# Altium schematic sheet Sheet1.SchDoc
size A4
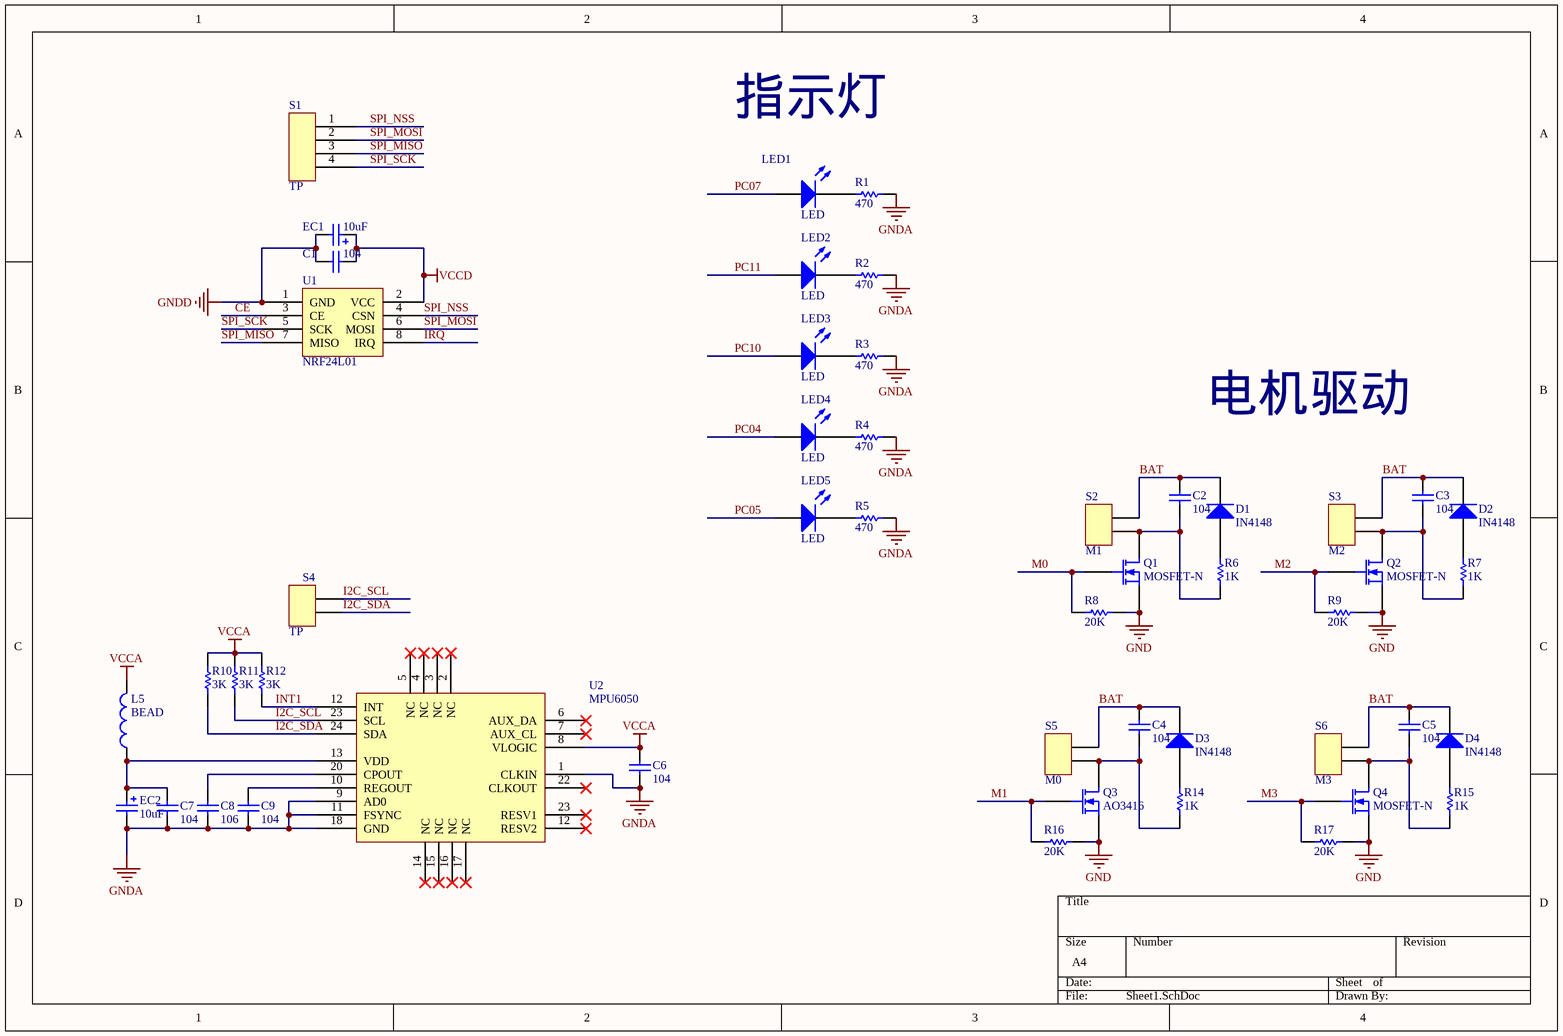
[diagram p0: Sheet1.SchDoc]

## Parts
C1  104  [0603]
C2  104  [0603]
C3  104  [0603]
C4  104  [0603]
C5  104  [0603]
C6  104  [0603]
C7  104  [0603]
C8  106  [0805]
C9  104  [0603]
D1  IN4148  [1206]
D2  IN4148  [1206]
D3  IN4148  [1206]
D4  IN4148  [1206]
EC1  10uF  [1206]
EC2  10uF  [1206]
L5  BEAD  [0603]
LED1  LED  [0805]
LED2  LED  [0805]
LED3  LED  [0805]
LED4  LED  [0805]
LED5  LED  [0805]
Q1  MOSFET-N  [SOT-23_N]
Q2  MOSFET-N  [SOT-23_N]
Q3  AO3416  [SOT-23_N]
Q4  MOSFET-N  [SOT-23_N]
R1  470  [0603]
R2  470  [0603]
R3  470  [0603]
R4  470  [0603]
R5  470  [0603]
R6  1K  [0603]
R7  1K  [0603]
R8  20K  [0603]
R9  20K  [0603]
R10  3K  [0603]
R11  3K  [0603]
R12  3K  [0603]
R14  1K  [0603]
R15  1K  [0603]
R16  20K  [0603]
R17  20K  [0603]
S1  TP  [TP4]
S2  M1  [0805]
S3  M2  [0805]
S4  TP  [TP2]
S5  M0  [0805]
S6  M3  [0805]
U1  NRF24L01  [CN8]
U2  MPU6050  [QFN50P400X400X95_HS-25N]

## Nets
GND: Q1.3(S) Q2.3(S) Q3.3(S) Q4.3(S) R8.2 R9.2 R16.2 R17.2
GNDA: C6.2 C7.1 C8.2 C9.2 EC2.2 R1.2 R2.2 R3.2 R4.2 R5.2 U2.1(CLKIN) U2.9(AD0) U2.11(FSYNC) U2.18(GND)
GNDD: C1.1 EC1.2 U1.1(GND)
VCCA: C6.1 L5.2 R10.2 R11.2 R12.2 U2.8(VLOGIC)
VCCD: C1.2 EC1.1 U1.2(VCC)
BAT: C2.2 C3.2 C4.2 C5.2 D1.2(K) D2.2(K) D3.2(K) D4.2(K) S2.1 S3.1 S5.1 S6.1
CE: U1.3(CE)
I2C_SCL: R11.1 S4.1 U2.23(SCL)
I2C_SDA: R10.1 S4.2 U2.24(SDA)
INT1: R12.1 U2.12(INT)
IRQ: U1.8(IRQ)
M0: Q1.2(G) R8.1
M1: Q3.2(G) R16.1
M2: Q2.2(G) R9.1
M3: Q4.2(G) R17.1
PC04: LED4.1(A)
PC05: LED5.1(A)
PC07: LED1.1(A)
PC10: LED3.1(A)
PC11: LED2.1(A)
SPI_MISO: S1.3 U1.7(MISO)
SPI_MOSI: S1.2 U1.6(MOSI)
SPI_NSS: S1.1 U1.4(CSN)
SPI_SCK: S1.4 U1.5(SCK)
NetC2_1: C2.1 Q1.1(D) R6.1 S2.2
NetC3_1: C3.1 Q2.1(D) R7.1 S3.2
NetC4_1: C4.1 Q3.1(D) R14.1 S5.2
NetC5_1: C5.1 Q4.1(D) R15.1 S6.2
NetC7_2: C7.2 EC2.1 L5.1 U2.13(VDD)
NetC8_1: C8.1 U2.20(CPOUT)
NetC9_1: C9.1 U2.10(REGOUT)
NetD1_1: D1.1(A) R6.2
NetD2_1: D2.1(A) R7.2
NetD3_1: D3.1(A) R14.2
NetD4_1: D4.1(A) R15.2
NetLED1_2: LED1.2(K) R1.1
NetLED2_2: LED2.2(K) R2.1
NetLED3_2: LED3.2(K) R3.1
NetLED4_2: LED4.2(K) R4.1
NetLED5_2: LED5.2(K) R5.1

Not connected (* = marked no-connect by the designer): U2 2(NC)* 3(NC)* 4(NC)* 5(NC)* 6(AUX_DA)* 7(AUX_CL)* 14(NC)* 15(NC)* 16(NC)* 17(NC)* 22(CLKOUT)*

## Notes on the sheet
- 指示灯
- 电机驱动

## Library data of the parts
C1-C9 = CAP
D1-D4 = DIODE
EC1 EC2 = EC
L5 = Inductor: Code_IEC: 1005; Published: 8-Jun-2000; LatestRevisionDate: 29-May-2009; LatestRevisionNote: IPC-7351 Footprint Added.; PackageReference: 0402-A; Publisher: Altium Limited; PackageDescription: Chip Inductor; Code_JEITA: 0402
Q1-Q4 = MOSFET-N: N-Channel MOSFET; Published: 8-Jun-2000; LatestRevisionDate: 17-Jul-2002; LatestRevisionNote: Re-released for DXP Platform.; PackageVersion: 1995/1996; PackageReference: E3; Publisher: Altium Limited; PackageDescription: TO, Flat Index; 3 In-Line, Axial Leads; Body Dia. 4.6mm; Lead Dia. 0.5 mm (max)
R1-R12 R14-R17 = RES
S1 = CON4
S2-S6 = CON2